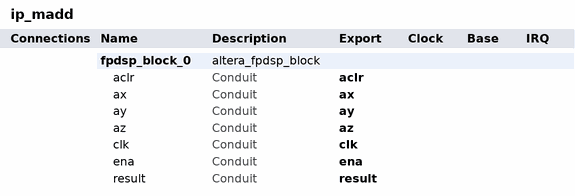
[diagram p0: system contents]
# Platform Designer (Qsys) system ip_madd, Arria 10 10AX115N2F45E1SG
# Parameters at their usual value, and those the tool derives, are not listed.
package require -exact qsys 18.1
create_system ip_madd
set_project_property DEVICE_FAMILY {Arria 10}
set_project_property DEVICE 10AX115N2F45E1SG

add_instance fpdsp_block_0 altera_fpdsp_block 18.1
set_instance_property fpdsp_block_0 AUTO_EXPORT true
set_instance_parameter_value fpdsp_block_0 OPERATION sp_mult_add
set_instance_parameter_value fpdsp_block_0 VIEW {Register Enables}
set_instance_parameter_value fpdsp_block_0 accum_adder_clock 0
set_instance_parameter_value fpdsp_block_0 accum_pipeline_clock 0
set_instance_parameter_value fpdsp_block_0 accumulate_clock 0
set_instance_parameter_value fpdsp_block_0 adder_input_2_clock 0
set_instance_parameter_value fpdsp_block_0 adder_input_clock 0
set_instance_parameter_value fpdsp_block_0 adder_subtract false
set_instance_parameter_value fpdsp_block_0 ax_chainin_pl_clock 0
set_instance_parameter_value fpdsp_block_0 ax_clock 0
set_instance_parameter_value fpdsp_block_0 ay_clock 0
set_instance_parameter_value fpdsp_block_0 az_clock 0
set_instance_parameter_value fpdsp_block_0 chain_mux 0
set_instance_parameter_value fpdsp_block_0 chain_out_mux 0
set_instance_parameter_value fpdsp_block_0 design_env QSYS
set_instance_parameter_value fpdsp_block_0 mult_pipeline_clock 0
set_instance_parameter_value fpdsp_block_0 output_clock 0
set_instance_parameter_value fpdsp_block_0 single_clear false

# exported interfaces
add_interface aclr conduit end
set_interface_property aclr EXPORT_OF fpdsp_block_0.aclr
add_interface ax conduit end
set_interface_property ax EXPORT_OF fpdsp_block_0.ax
add_interface ay conduit end
set_interface_property ay EXPORT_OF fpdsp_block_0.ay
add_interface az conduit end
set_interface_property az EXPORT_OF fpdsp_block_0.az
add_interface clk conduit end
set_interface_property clk EXPORT_OF fpdsp_block_0.clk
add_interface ena conduit end
set_interface_property ena EXPORT_OF fpdsp_block_0.ena
add_interface result conduit end
set_interface_property result EXPORT_OF fpdsp_block_0.result

set_interconnect_requirement {$system} qsys_mm.clockCrossingAdapter HANDSHAKE
set_interconnect_requirement {$system} qsys_mm.enableEccProtection FALSE
set_interconnect_requirement {$system} qsys_mm.insertDefaultSlave FALSE
set_interconnect_requirement {$system} qsys_mm.maxAdditionalLatency 1

save_system ip_madd.qsys
